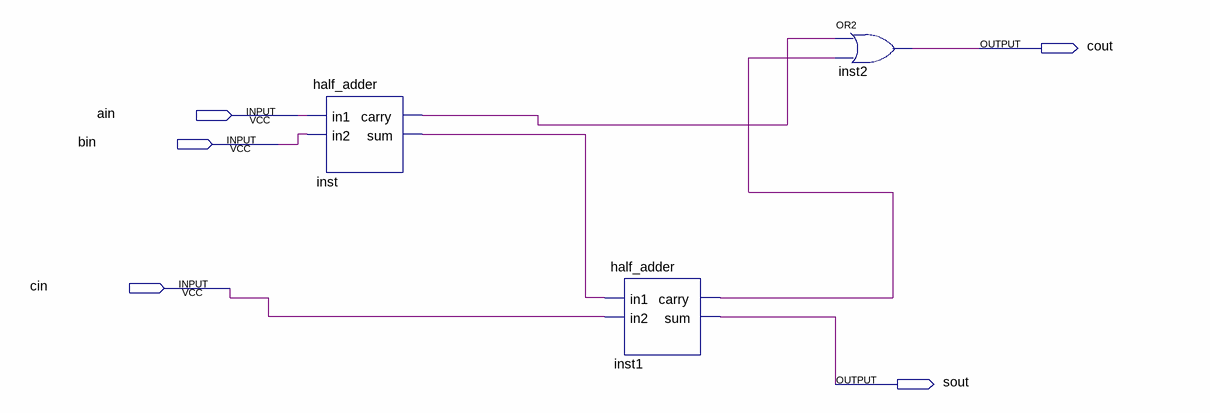
[diagram p0: schematic sheet]
// Quartus schematic full_adder.bdf as structural Verilog: 3 symbols, 5 pins
module full_adder (
  input  ain,
  input  bin,
  input  cin,
  output cout,
  output sout
);

  wire inst1_carry, inst_carry, inst_sum;

  half_adder inst (.in1(ain), .in2(bin), .carry(inst_carry), .sum(inst_sum));
  half_adder inst1 (.in1(inst_sum), .in2(cin), .carry(inst1_carry), .sum(sout));
  or inst2 (cout, inst_carry, inst1_carry);
endmodule
